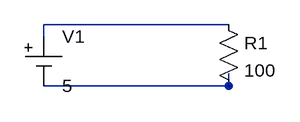
[diagram p0: schematic Simulation1.asc]
Simulation1.asc, the LTspice schematic file:
Version 4
SHEET 1 880 680
WIRE 192 144 -48 144
WIRE -48 160 -48 144
WIRE 192 224 192 208
WIRE 192 224 -48 224
SYMBOL res 176 128 R0
SYMATTR InstName R1
SYMATTR Value 100
SYMBOL Misc\\cell -48 160 R0
WINDOW 123 0 0 Left 0
WINDOW 39 0 0 Left 0
SYMATTR InstName V1
SYMATTR Value 5

The netlist it stands for:
* Simulation1.asc
R1 N001 N002 100
V1 N001 N002 5
.backanno
.end